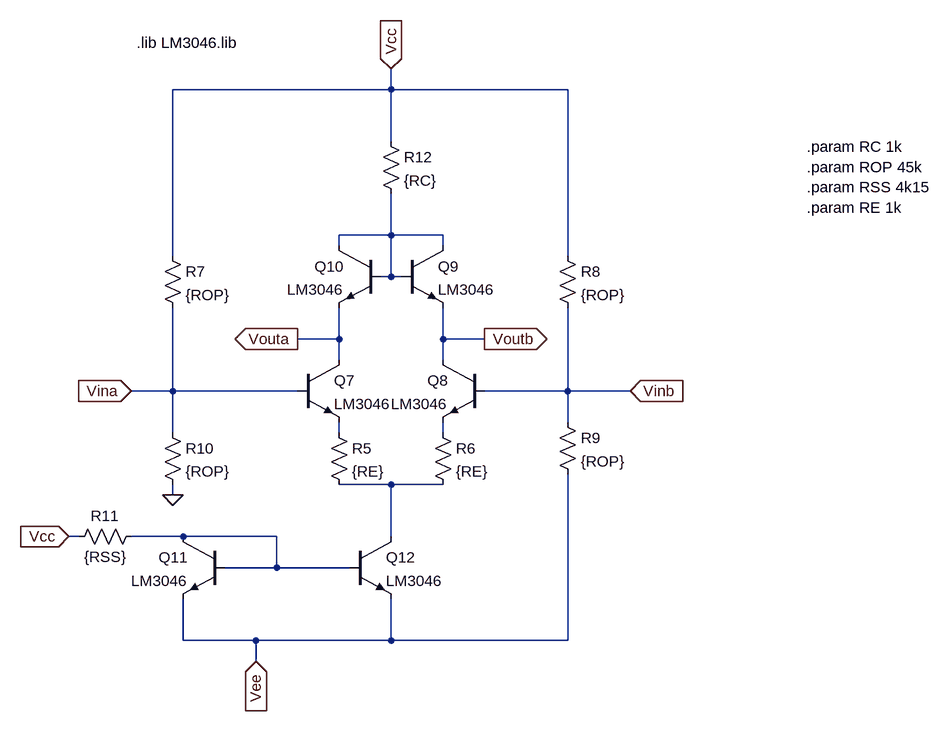
[diagram p0: schematic Logarithmierer.asc]
Logarithmierer.asc, the LTspice schematic file:
Version 4
SHEET 1 1652 1068
WIRE 784 80 784 48
WIRE 784 80 448 80
WIRE 1056 80 784 80
WIRE 784 160 784 80
WIRE 784 304 784 240
WIRE 784 304 704 304
WIRE 864 304 784 304
WIRE 704 320 704 304
WIRE 864 320 864 304
WIRE 448 336 448 80
WIRE 1056 336 1056 80
WIRE 784 368 784 304
WIRE 784 368 768 368
WIRE 800 368 784 368
WIRE 704 464 704 416
WIRE 704 464 640 464
WIRE 864 464 864 416
WIRE 928 464 864 464
WIRE 704 496 704 464
WIRE 864 496 864 464
WIRE 448 544 448 416
WIRE 448 544 384 544
WIRE 640 544 448 544
WIRE 1056 544 1056 416
WIRE 1056 544 928 544
WIRE 1152 544 1056 544
WIRE 1056 592 1056 544
WIRE 448 608 448 544
WIRE 704 608 704 592
WIRE 864 608 864 592
WIRE 784 688 704 688
WIRE 864 688 784 688
WIRE 448 704 448 688
WIRE 304 768 288 768
WIRE 464 768 384 768
WIRE 608 768 464 768
WIRE 784 768 784 688
WIRE 608 816 608 768
WIRE 608 816 528 816
WIRE 720 816 608 816
WIRE 464 928 464 864
WIRE 576 928 464 928
WIRE 784 928 784 864
WIRE 784 928 576 928
WIRE 1056 928 1056 672
WIRE 1056 928 784 928
WIRE 576 960 576 928
FLAG 448 704 0
FLAG 288 768 Vcc
IOPIN 288 768 In
FLAG 640 464 Vouta
IOPIN 640 464 Out
FLAG 928 464 Voutb
IOPIN 928 464 Out
FLAG 384 544 Vina
IOPIN 384 544 In
FLAG 1152 544 Vinb
IOPIN 1152 544 In
FLAG 576 960 Vee
IOPIN 576 960 In
FLAG 784 48 Vcc
IOPIN 784 48 In
SYMBOL npn 640 496 R0
SYMATTR InstName Q7
SYMATTR Value LM3046
SYMBOL npn 928 496 M0
SYMATTR InstName Q8
SYMATTR Value LM3046
SYMBOL res 688 592 R0
SYMATTR InstName R5
SYMATTR Value {RE}
SYMBOL res 848 592 R0
SYMATTR InstName R6
SYMATTR Value {RE}
SYMBOL npn 800 320 R0
SYMATTR InstName Q9
SYMATTR Value LM3046
SYMBOL npn 768 320 M0
SYMATTR InstName Q10
SYMATTR Value LM3046
SYMBOL npn 528 768 M0
SYMATTR InstName Q11
SYMATTR Value LM3046
SYMBOL npn 720 768 R0
SYMATTR InstName Q12
SYMATTR Value LM3046
SYMBOL res 432 320 R0
SYMATTR InstName R7
SYMATTR Value {ROP}
SYMBOL res 1040 320 R0
SYMATTR InstName R8
SYMATTR Value {ROP}
SYMBOL res 1040 576 R0
SYMATTR InstName R9
SYMATTR Value {ROP}
SYMBOL res 432 592 R0
SYMATTR InstName R10
SYMATTR Value {ROP}
SYMBOL res 400 752 R90
WINDOW 0 0 56 VBottom 2
WINDOW 3 32 56 VTop 2
SYMATTR InstName R11
SYMATTR Value {RSS}
SYMBOL res 768 144 R0
SYMATTR InstName R12
SYMATTR Value {RC}
TEXT 392 8 Left 2 !.lib LM3046.lib
TEXT 1424 168 Left 2 !.param RC 1k\n.param ROP 45k\n.param RSS 4k15\n.param RE 1k

The netlist it stands for:
* Logarithmierer.asc
Q7 Vouta Vina N002 0 LM3046
Q8 Voutb Vinb N003 0 LM3046
R5 N002 N004 {RE}
R6 N003 N004 {RE}
Q9 N001 N001 Voutb 0 LM3046
Q10 N001 N001 Vouta 0 LM3046
Q11 N005 N005 Vee 0 LM3046
Q12 N004 N005 Vee 0 LM3046
R7 Vcc Vina {ROP}
R8 Vcc Vinb {ROP}
R9 Vinb Vee {ROP}
R10 Vina 0 {ROP}
R11 N005 Vcc {RSS}
R12 Vcc N001 {RC}
.model NPN NPN
.model PNP PNP
.lib standard.bjt
.lib LM3046.lib
.param RC 1k
.param ROP 45k
.param RSS 4k15
.param RE 1k
.backanno
.end